# Altium schematic sheet MAIN BOARD POWER.SchDoc: BULLSEYE
size A3; CompanyName: TYMPHANY; DrawnBy: Yetta.He; Organization: PABU; Address1: 11F,block A, CEC building,; Address2: No.2070 Shennan Zhong road,; Address3: Huaqiang North, Futian District,; Address4: Shenzhen,  Guang Dong, P.R.C 518000; DocumentNumber: 7; Revision: 0.0.5; SheetNumber: 7; SheetTotal: 7; Size: A3; Status: DP1
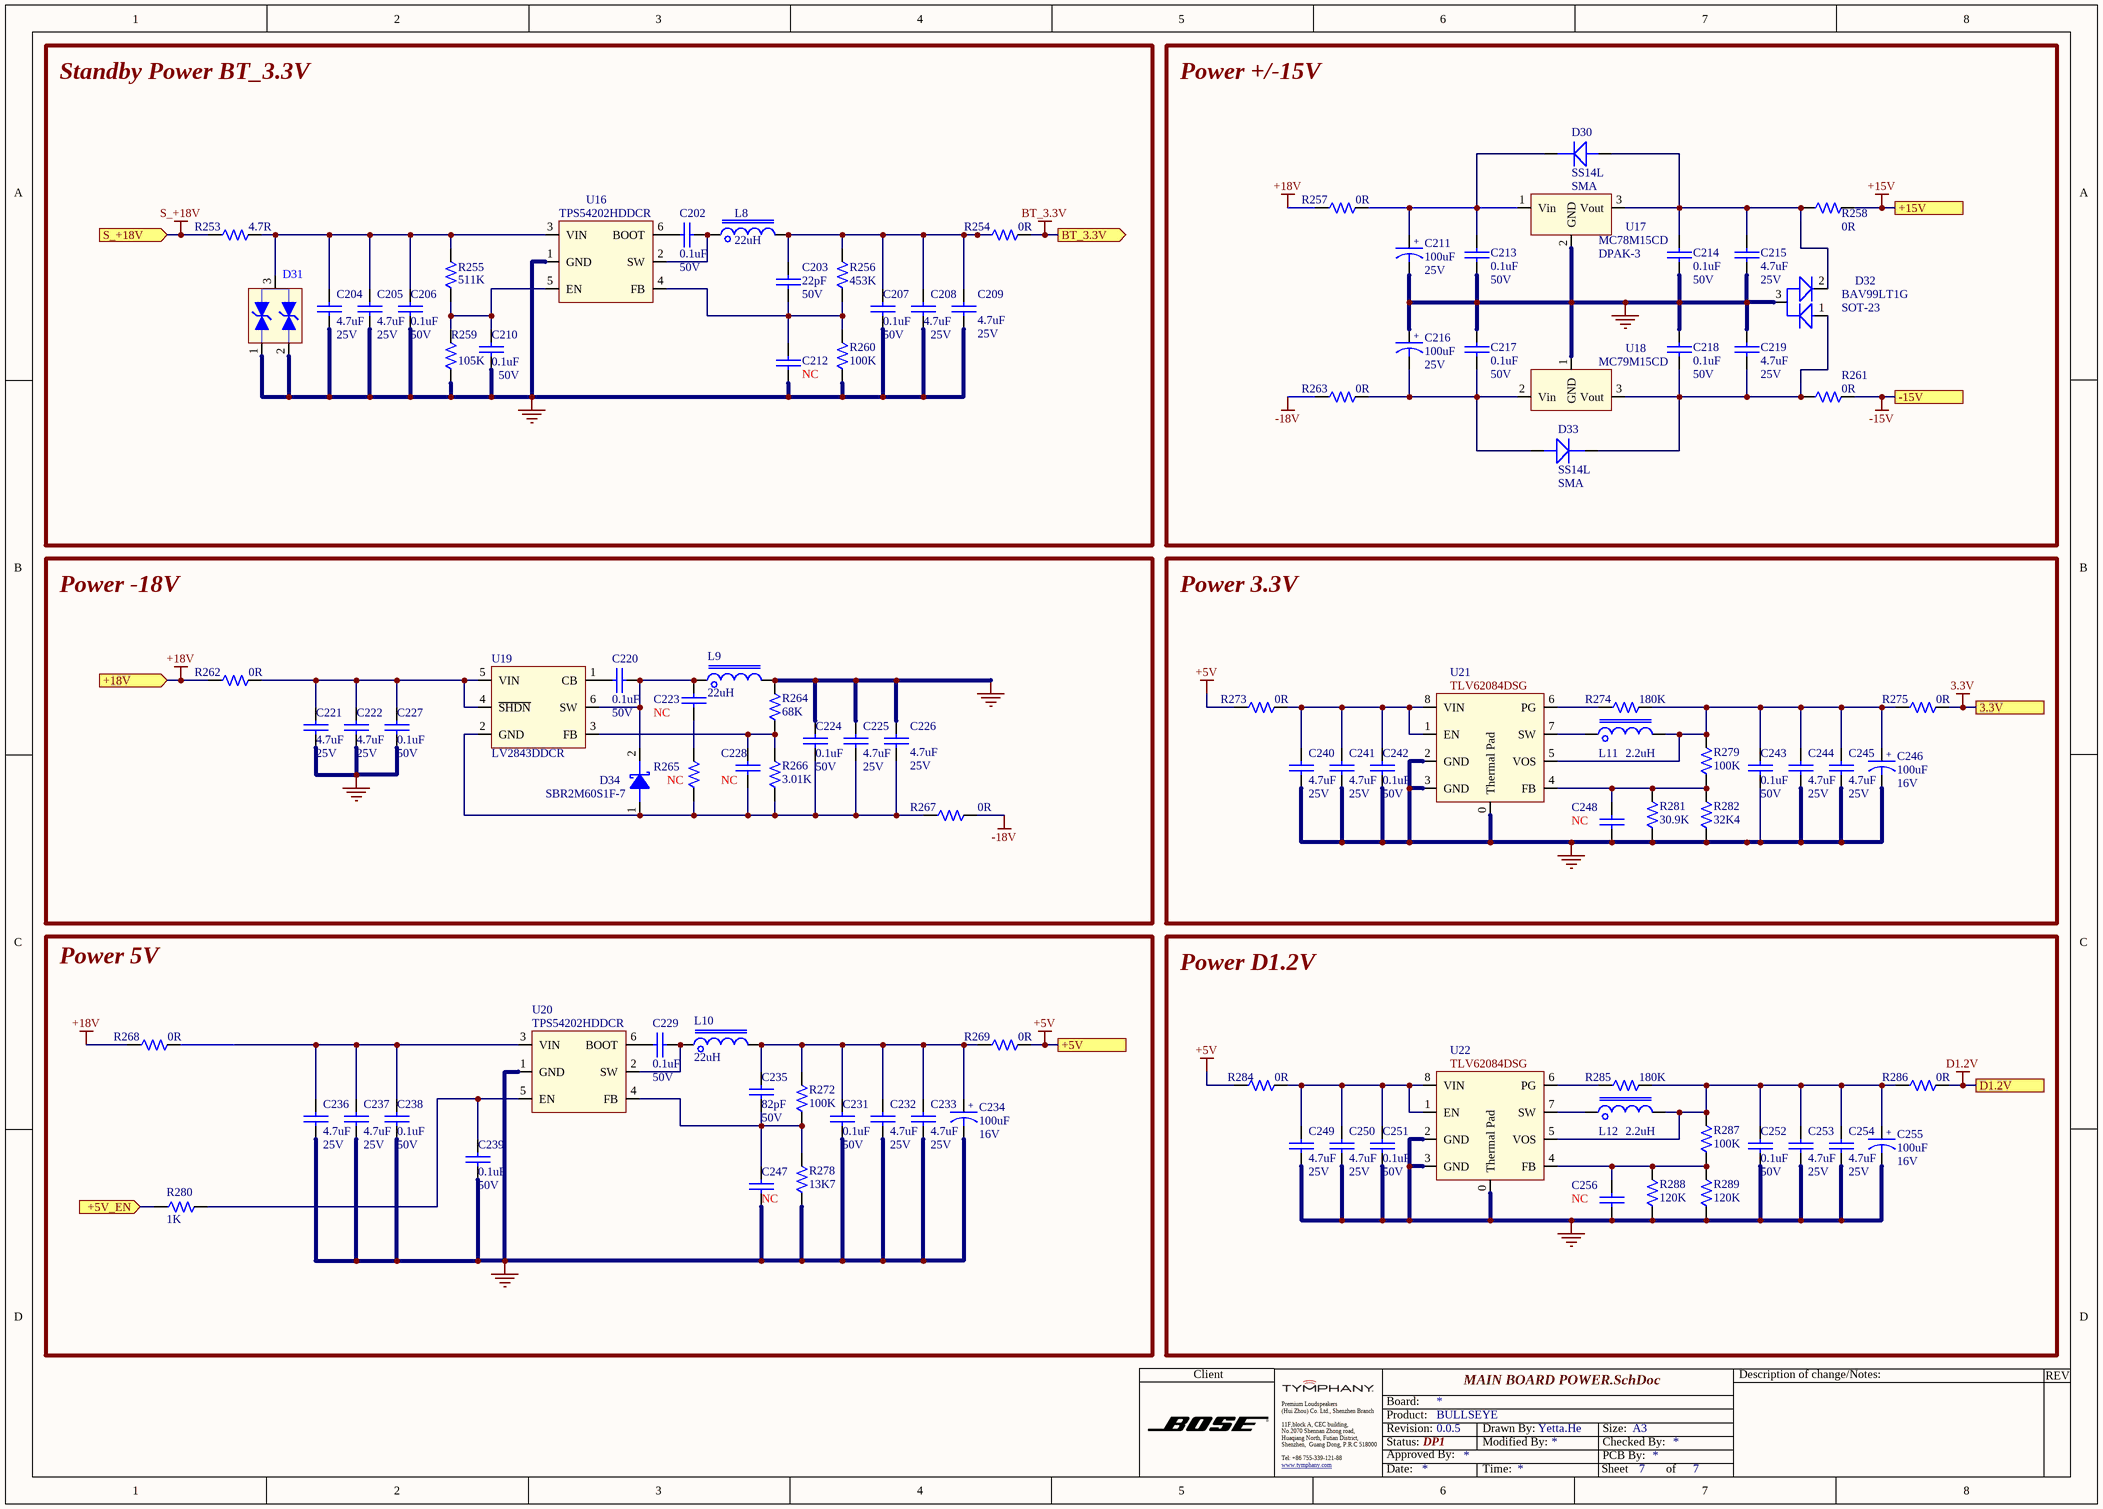
[diagram p0: MAIN BOARD POWER.SchDoc]

## Parts
C202  value 0.1uF  Voltage: 50V  [CAPC0402-RW]  (hidden comment: PWL456470-1040)
C203  value 22pF  Voltage: 50V  [CAPC0402-RW]  (hidden comment: PWL410370-2200)
C204  value 4.7uF  Voltage: 25V  [CAPC0603-RW]  (hidden comment: T542024757408)
C205  value 4.7uF  Voltage: 25V  [CAPC0603-RW]  (hidden comment: T542024757408)
C206  value 0.1uF  Voltage: 50V  [CAPC0402-RW]  (hidden comment: PWL456470-1040)
C207  value 0.1uF  Voltage: 50V  [CAPC0402-RW]  (hidden comment: PWL456470-1040)
C208  value 4.7uF  Voltage: 25V  [CAPC0603-RW]  (hidden comment: T542024757408)
C209  value 4.7uF  Voltage: 25V  [CAPC0603-RW]  (hidden comment: T542024757408)
C210  value 0.1uF  Voltage: 50V  [CAPC0402-RW]  (hidden comment: PWL456470-1040)
C211  value 100uF  Voltage: 25V  [CASE - D8]  (hidden comment: T551101445020)
C212  value NC  [CAPC0603-RW]  (hidden comment: CAP0603 NC)
C213  value 0.1uF  Voltage: 50V  [CAPC0402-RW]  (hidden comment: PWL456470-1040)
C214  value 0.1uF  Voltage: 50V  [CAPC0402-RW]  (hidden comment: PWL456470-1040)
C215  value 4.7uF  Voltage: 25V  [CAPC0603-RW]  (hidden comment: T542024757408)
C216  value 100uF  Voltage: 25V  [CASE - D8]  (hidden comment: T551101445020)
C217  value 0.1uF  Voltage: 50V  [CAPC0402-RW]  (hidden comment: PWL456470-1040)
C218  value 0.1uF  Voltage: 50V  [CAPC0402-RW]  (hidden comment: PWL456470-1040)
C219  value 4.7uF  Voltage: 25V  [CAPC0603-RW]  (hidden comment: T542024757408)
C220  value 0.1uF  Voltage: 50V  [CAPC0402-RW]  (hidden comment: PWL456470-1040)
C221  value 4.7uF  Voltage: 25V  [CAPC0603-RW]  (hidden comment: T542024757408)
C222  value 4.7uF  Voltage: 25V  [CAPC0603-RW]  (hidden comment: T542024757408)
C223  value NC  [CAPC0603-RW]  (hidden comment: CAP0603 NC)
C224  value 0.1uF  Voltage: 50V  [CAPC0402-RW]  (hidden comment: PWL456470-1040)
C225  value 4.7uF  Voltage: 25V  [CAPC0603-RW]  (hidden comment: T542024757408)
C226  value 4.7uF  Voltage: 25V  [CAPC0603-RW]  (hidden comment: T542024757408)
C227  value 0.1uF  Voltage: 50V  [CAPC0402-RW]  (hidden comment: PWL456470-1040)
C228  value NC  [CAPC0402-RW]  (hidden comment: CAP0402 NC)
C229  value 0.1uF  Voltage: 50V  [CAPC0402-RW]  (hidden comment: PWL456470-1040)
C231  value 0.1uF  Voltage: 50V  [CAPC0402-RW]  (hidden comment: PWL456470-1040)
C232  value 4.7uF  Voltage: 25V  [CAPC0603-RW]  (hidden comment: T542024757408)
C233  value 4.7uF  Voltage: 25V  [CAPC0603-RW]  (hidden comment: T542024757408)
C234  value 100uF  Voltage: 16V  [CASE - D]  (hidden comment: T551101435040)
C235  value 82pF  Voltage: 50V  [CAPC0603-RW]  (hidden comment: T541028206508)
C236  value 4.7uF  Voltage: 25V  [CAPC0603-RW]  (hidden comment: T542024757408)
C237  value 4.7uF  Voltage: 25V  [CAPC0603-RW]  (hidden comment: T542024757408)
C238  value 0.1uF  Voltage: 50V  [CAPC0402-RW]  (hidden comment: PWL456470-1040)
C239  value 0.1uF  Voltage: 50V  [CAPC0402-RW]  (hidden comment: PWL456470-1040)
C240  value 4.7uF  Voltage: 25V  [CAPC0603-RW]  (hidden comment: T542024757408)
C241  value 4.7uF  Voltage: 25V  [CAPC0603-RW]  (hidden comment: T542024757408)
C242  value 0.1uF  Voltage: 50V  [CAPC0402-RW]  (hidden comment: PWL456470-1040)
C243  value 0.1uF  Voltage: 50V  [CAPC0402-RW]  (hidden comment: PWL456470-1040)
C244  value 4.7uF  Voltage: 25V  [CAPC0603-RW]  (hidden comment: T542024757408)
C245  value 4.7uF  Voltage: 25V  [CAPC0603-RW]  (hidden comment: T542024757408)
C246  value 100uF  Voltage: 16V  [CASE - D]  (hidden comment: T551101435040)
C247  value NC  [CAPC0603-RW]  (hidden comment: CAP0603 NC)
C248  value NC  [CAPC0402-RW]  (hidden comment: CAP0402 NC)
C249  value 4.7uF  Voltage: 25V  [CAPC0603-RW]  (hidden comment: T542024757408)
C250  value 4.7uF  Voltage: 25V  [CAPC0603-RW]  (hidden comment: T542024757408)
C251  value 0.1uF  Voltage: 50V  [CAPC0402-RW]  (hidden comment: PWL456470-1040)
C252  value 0.1uF  Voltage: 50V  [CAPC0402-RW]  (hidden comment: PWL456470-1040)
C253  value 4.7uF  Voltage: 25V  [CAPC0603-RW]  (hidden comment: T542024757408)
C254  value 4.7uF  Voltage: 25V  [CAPC0603-RW]  (hidden comment: T542024757408)
C255  value 100uF  Voltage: 16V  [CASE - D]  (hidden comment: T551101435040)
C256  value NC  [CAPC0402-RW]  (hidden comment: CAP0402 NC)
D30  MFG Part: SS14L  Package: SMA  [subSMA]  (hidden comment: RCD100140-0010)
D31  RCD100012-0001  [SOT23-132-RW]  (value not drawn)
D32  Package: SOT-23  [SOT23-132-RW]  (hidden comment: RCD100099-0010)
D33  MFG Part: SS14L  Package: SMA  [subSMA]  (hidden comment: RCD100140-0010)
D34  MFG Part: SBR2M60S1F-7  [SOD-123]  (hidden comment: T572006161416)
L8  value 22uH  [IND CKST0505]  (hidden comment: T621000054100)
L9  value 22uH  [IND CKST0505]  (hidden comment: T621000054100)
L10  value 22uH  [IND CKST0505]  (hidden comment: T621000054100)
L11  value 2.2uH  [IND CKCD3D16]  (hidden comment: T621000042300)
L12  value 2.2uH  [IND CKCD3D16]  (hidden comment: T621000042300)
R253  value 4.7R  [0805-RW]  (hidden comment: QCF081020-4708)
R254  value 0R  [0805-RW]  (hidden comment: T502000003009)
R255  value 511K  [0603-RW]  (hidden comment: QCF011030-5113)
R256  value 453K  [0402-RW]  (hidden comment: T502453301399)
R257  value 0R  [0805-RW]  (hidden comment: T502000003009)
R258  value 0R  [0805-RW]  (hidden comment: T502000003009)
R259  value 105K  [0603-RW]  (hidden comment: T502105302399)
R260  value 100K  [0603-RW]  (hidden comment: QCF011030-1003)
R261  value 0R  [0805-RW]  (hidden comment: T502000003009)
R262  value 0R  [0805-RW]  (hidden comment: T502000003009)
R263  value 0R  [0805-RW]  (hidden comment: T502000003009)
R264  value 68K  [0603-RW]  (hidden comment: QCF011030-6802)
R265  value NC  [0603-RW]  (hidden comment: RES0603 NC)
R266  value 3.01K  [0603-RW]  (hidden comment: QCF011030-3011)
R267  value 0R  [0805-RW]  (hidden comment: T502000003009)
R268  value 0R  [0805-RW]  (hidden comment: T502000003009)
R269  value 0R  [0805-RW]  (hidden comment: T502000003009)
R272  value 100K  [0603-RW]  (hidden comment: QCF011030-1003)
R273  value 0R  [0805-RW]  (hidden comment: T502000003009)
R274  value 180K  [0402-RW]  (hidden comment: QCF161240-1803)
R275  value 0R  [0805-RW]  (hidden comment: T502000003009)
R278  value 13K7  [0603-RW]  (hidden comment: T502137202399)
R279  value 100K  [0603-RW]  (hidden comment: QCF011030-1003)
R280  value 1K  [0603-RW]  (hidden comment: QCF011030-1001)
R281  value 30.9K  [0603-RW]  (hidden comment: QCF011030-3092)
R282  value 32K4  [0402-RW]  (hidden comment: QCF161240-3242)
R284  value 0R  [0805-RW]  (hidden comment: T502000003009)
R285  value 180K  [0402-RW]  (hidden comment: QCF161240-1803)
R286  value 0R  [0805-RW]  (hidden comment: T502000003009)
R287  value 100K  [0603-RW]  (hidden comment: QCF011030-1003)
R288  value 120K  [0603-RW]  (hidden comment: QCF011030-1203)
R289  value 120K  [0603-RW]  (hidden comment: QCF011030-1203)
U16  MFG Part: TPS54202HDDCR  [SOT23-6 P.95]  (hidden comment: T611700039022)
U17  T610600097341  [DPAK-3]  (value not drawn)
U18  T610600097241  [DPAK-3]  (value not drawn)
U19  MFG Part: LV2843DDCR  [DBV(R-PDSO-G6)]  (hidden comment: RCI002843-0001)
U20  MFG Part: TPS54202HDDCR  [SOT23-6 P.95]  (hidden comment: T611700039022)
U21  T611700037422  [DSG(S-PWSON-N8)]  (value not drawn)
U22  T611700037422  [DSG(S-PWSON-N8)]  (value not drawn)

## Blocks framed on the sheet
Standby Power BT_3.3V: C202-C210 C212 D31 L8 R253-R256 R259 R260 U16
Power +/-15V: C211 C213-C219 D30 D32 D33 R257 R258 R261 R263 U17 U18
Power -18V: C220-C228 D34 L9 R262 R264-R267 U19
Power 3.3V: C240-C246 C248 L11 R273-R275 R279 R281 R282 U21
Power 5V: C229 C231-C239 C247 L10 R268 R269 R272 R278 R280 U20
Power D1.2V: C249-C256 L12 R284-R289 U22

## Ports
3.3V, +5V, +5V_EN (in), +15V, +18V (in), -15V, BT_3.3V (out), D1.2V, S_+18V (in)

## Nets
3.3V: R275.2 ; port 3.3V
+5V: R269.2 R273.1 R284.1 ; port +5V
+15V: R258.2 ; port +15V
+18V: R257.1 R262.1 R268.1 ; port +18V
-15V: R261.2 ; port -15V
-18V: R263.1 R267.2
BT_3.3V: R254.2 ; port BT_3.3V
D1.2V: R286.2 ; port D1.2V
GND: C204.2 C205.2 C206.2 C207.2 C208.2 C209.2 C210.2 C211.2 C212.2 C213.2 C214.2 C215.2 C216.1 C217.1 C218.1 C219.1 C221.2 C222.2 C224.1 C225.1 C226.1 C227.2 C231.2 C232.2 C233.2 C234.2 C236.2 C237.2 C238.2 C239.2 C240.2 C241.2 C242.2 C243.2 C244.2 C245.2 C246.2 C247.2 C248.2 C249.2 C250.2 C251.2 C252.2 C253.2 C254.2 C255.2 C256.2 D31.1(A) D31.2(A) D32.3(K) L9.2 R259.1 R260.1 R264.2 R278.1 R281.1 R282.1 R288.1 R289.1 U16.1(GND) U17.2(GND) U18.1(GND) U20.1(GND) U21.0(Thermal_Pad) U21.2(GND) U21.3(GND) U22.0(Thermal_Pad) U22.2(GND) U22.3(GND)
S_+18V: R253.1 ; port S_+18V
+5V_EN: R280.1 ; port +5V_EN
NetC202_1: C202.1 U16.6(BOOT)
NetC202_2: C202.2 L8.1 U16.2(SW)
NetC203_1: C203.1 C207.1 C208.1 C209.1 L8.2 R254.1 R256.2
NetC203_2: C203.2 C212.1 R256.1 R260.2 U16.4(FB)
NetC204_1: C204.1 C205.1 C206.1 D31.3(K) R253.2 R255.2 U16.3(VIN)
NetC210_1: C210.1 R255.1 R259.2 U16.5(EN)
NetC211_1: C211.1 C213.1 D30.2(K) R257.2 U17.1(Vin)
NetC214_1: C214.1 C215.1 D30.1(A) D32.2(A) R258.1 U17.3(Vout)
NetC216_2: C216.2 C217.2 D33.1(A) R263.2 U18.2(Vin)
NetC218_2: C218.2 C219.2 D32.1(A) D33.2(K) R261.1 U18.3(Vout)
NetC220_1: C220.1 U19.1(CB)
NetC220_2: C220.2 C223.1 D34.2(K) L9.1 U19.6(SW)
NetC221_1: C221.1 C222.1 C227.1 R262.2 U19.4(~{SHDN}) U19.5(VIN)
NetC223_2: C223.2 R265.2
NetC224_2: C224.2 C225.2 C226.2 C228.2 D34.1(A) R265.1 R266.1 R267.1 U19.2(GND)
NetC228_1: C228.1 R264.1 R266.2 U19.3(FB)
NetC229_1: C229.1 U20.6(BOOT)
NetC229_2: C229.2 L10.1 U20.2(SW)
NetC231_1: C231.1 C232.1 C233.1 C234.1 C235.1 L10.2 R269.1 R272.2
NetC235_2: C235.2 C247.1 R272.1 R278.2 U20.4(FB)
NetC236_1: C236.1 C237.1 C238.1 R268.2 U20.3(VIN)
NetC239_1: C239.1 R280.2 U20.5(EN)
NetC240_1: C240.1 C241.1 C242.1 R273.2 U21.1(EN) U21.8(VIN)
NetC243_1: C243.1 C244.1 C245.1 C246.1 L11.2 R274.2 R275.1 R279.2 U21.5(VOS)
NetC248_1: C248.1 R279.1 R281.2 R282.2 U21.4(FB)
NetC249_1: C249.1 C250.1 C251.1 R284.2 U22.1(EN) U22.8(VIN)
NetC252_1: C252.1 C253.1 C254.1 C255.1 L12.2 R285.2 R286.1 R287.2 U22.5(VOS)
NetC256_1: C256.1 R287.1 R288.2 R289.2 U22.4(FB)
NetL11_1: L11.1 U21.7(SW)
NetL12_1: L12.1 U22.7(SW)
NetR274_1: R274.1 U21.6(PG)
NetR285_1: R285.1 U22.6(PG)

## Notes on the sheet
- Client
- Description of change/Notes:
- REV
- Premium Loudspeakers
- (Hui Zhou) Co. Ltd., Shenzhen Branch
- Tel: +86 755-339-121-88
- Board:
- Status:
- Revision:
- Product:
- Approved By:
- Drawn By:
- Modified By:
- Checked By:
- PCB By:
- Size:
- www.tymphany.com <http://www.tymphany.com>
- Date:
- Time:
- Sheet
- of
- (in symbol CAP E 100uF 16V 20% SMD-VZH101M1CTR-0605) +
- (in symbol CAP E 100uF 25V 20% SMD_VEJ101M1ETR-0607) +

## Library data of the parts
C202 C206 C207 C210 C213 C214 C217 C218 C220 C224 C227 C229 C231 C238 C239 C242 C243 C251 C252 = CAP0402 0.1uF 50V 10%: CAP X7R .10UF 50V +-10% 0402 WALSIN L; SAP: T542011047508; Tolerance: 10%; Type: Capacitor; CREATE_NAME: TOM@Deftronics; DIP&SMD: SMD; PACKAGE: CAPC0402; Vendor Name: *; MFG: *; MFG Part: *; Other: X7R; CREATE_TIME: 13-May-2014; Customer Specific: N/A
C203 = CAP0402 22pF 50V 5%: CHIP CAP 5% 50V 0402 NPO 22pF; SAP: T541012206508; Type: Capacitor; CREATE_NAME: GordonL@Deftronics; DIP&SMD: SMD; PACKAGE: CAPC0402; Vendor Code: *; Vendor Name: *; MFG: *; MFG Part: *; Other: NPO; Tolerance: 5%; CREATE_TIME: 08-MAR-2013; Customer Specific: N/A
C204 C205 C215 C219 C221 C222 C225 C226 C236 C237 C240 C241 C249 C250 = CAP0603 4.7uF 25V 10%_X7R_WALSIN: CAP X7R 4.7UF 25V +-10% 0603 WALSIN L; Tolerance: 10%; Type: Capacitor; CREATE_NAME: Nathan; DIP&SMD: SMD; SAP: T542024757408; PACKAGE: CAPC0603; Vendor Name: *; MFG: WALSIN; MFG Part: *; Other: X7R; CREATE_TIME: 13-July-2016; Customer Specific: N/A
C208 C209 C232 C233 C244 C245 C253 C254 = CAP0603 4.7uF 25V 10%_X7R_WALSIN: CAP X7R 4.7UF 25V +-10% 0603 WALSIN L; Tolerance: 10%; Type: Capacitor; DIP&SMD: SMD; CREATE_NAME: Nathan; SAP: T542024757408; PACKAGE: CAPC0603; Vendor Name: *; MFG: WALSIN; MFG Part: *; Other: X7R; Customer Specific: N/A; CREATE_TIME: 13-July-2016
C211 C216 = CAP E 100uF 25V 20% SMD_VEJ101M1ETR-0607: E 100UF 25V +-20% 6.3X7. VEJ101M1E K; MFG: LELON; Tolerance: 20%; Type: Capacitor; CREATE_NAME: Nathan; DIP&SMD: SMD; SAP: T551101445020; PACKAGE: CASE - C7.7; Vendor Name: *; Vendor Code: *; MFG Part: VEJ101M1ETR-0607; Other: *; CREATE_TIME: 01-Mar-2019; Customer Specific: N/A
C212 C223 C247 = CAP0603 NC: NC; Type: Capacitor; CREATE_NAME: Tom; DIP&SMD: SMD; SAP: *; PACKAGE: CAPC0603; Vendor Code: *; Vendor Name: *; MFG: *; MFG Part: *; Other: *; Tolerance: *; CREATE_TIME: 18-Mar-2016; Voltage: *; Customer Specific: N/A
C228 C248 C256 = CAP0402 NC: NC; Type: Capacitor; CREATE_NAME: Tom; DIP&SMD: SMD; SAP: *; PACKAGE: CAPC0402; Vendor Code: *; Vendor Name: *; MFG: *; MFG Part: *; Other: *; Tolerance: *; CREATE_TIME: 18-Mar-2016; Voltage: *; Customer Specific: N/A
C234 = CAP E 100uF 16V 20% SMD-VZH101M1CTR-0605: E 100UF 16V +-20% 6.3*5. VZH101M1C L; MFG: LELON; Tolerance: 20%; Type: Capacitor; CREATE_NAME: Nathan; DIP&SMD: SMD; SAP: T551101435040; PACKAGE: CASE - D; Vendor Name: *; Vendor Code: *; MFG Part: VZH101M1CTR-0605; Other: *; CREATE_TIME: 03-May-2019; Customer Specific: N/A
C235 = CAP0603 82pF 50V 5%_NPO_WALSIN: CAP NPO 82PF 50V +-5% 0603 WALSIN L; Tolerance: 5%; Type: Capacitor; CREATE_NAME: Nathan; SAP: T541028206508; PACKAGE: CAPC0603; Vendor Name: *; MFG: WALSIN; MFG Part: *; Other: NPO; CREATE_TIME: 25-Oct-2016
C246 C255 = CAP E 100uF 16V 20% SMD-VZH101M1CTR-0605: E 100UF 16V +-20% 6.3*5. VZH101M1C L; MFG: LELON; Type: Capacitor; CREATE_NAME: Nathan; DIP&SMD: SMD; Tolerance: 20%; SAP: T551101435040; PACKAGE: CASE - D; MFG Part: VZH101M1CTR-0605; Other: *; CREATE_TIME: 03-May-2019; Customer Specific: N/A; Vendor Name: *; Vendor Code: *
D30 D33 = SS14L-TSC: SMD Schottky Diode Sub SMA 1A 40V SS14L; MFG: TSC; SAP: T571000130604; Vendor Name: *; Vendor Code: *; Voltage: 40V; Current: 1A; Type: DIODE; DIP&SMD: SMD; Customer Specific: N/A
D31 = ESDCAN01-2BLY: CHIP DIODE ESD CAN01-2BLY SOT23 24V 5.5A; MFG: ST; SAP: T593000205100; Ppp: 230W; CREATE_NAME: Nathan; Type: ESD DIODE; Ipp: 5.5A; Vendor Code: *; Vendor Name: *; CREATE_TIME: 21-Apr-2015; Vrm: 24V; MFG Part: ESDCAN01-2BLY
D32 = BAV99LT1G: SWITC 70V 215MA BAV99LT1G ON SE G; SAP: T572003550122; MFG: ON SEMI; Voltage: 100V; Power: 225MW; Type: DIODE; DIP&SMD: SMD; Vendor Code: *; Vendor Name: *; Current: 215mA; Customer Specific: N/A; MFG Part: BAV99LT1G
D34 = DIO SBR2M60S1F-7: SWITC 0.7V 2A SBR2M60S1F-7 DIODE L; MFG: DIODES; Voltage: 50V; Current: 5.0A; CREATE_NAME: Nathan; DIP&SMD: SMD; SAP: T572006161416; Vendor Name: *; Vendor Code: *; CREATE_TIME: 16-Mar-2017; Type: DIODE; Package: SOD123F; Customer Specific: N/A
L8-L10 = IND 22uH CKST0505-22UH\M: 22UH 2 5A 100K 5.7X CENKER CKST050 K; Type: INDUCTOR; CREATE_NAME: Nathan; Irms: 1.5A; DCR: 238mΩ; Isat: 2.5A; DIP&SMD: SMD; SAP: T621000054100; MFG: CENKER; Vendor Code: *; Vendor Name: *; CREATE_TIME: 27-Dec-2017; MFG Part: CKST0505-22UH\M
L11 L12 = IND 2.2uH CKCD3D16-2.2uH: 2.2UH 1.5A 100K SMD CENKER CKCD3D1 K; MFG Part: CKCD3D16-2.2UH\N; Type: INDUCTOR; CREATE_NAME: Nathan; DCR: 100mOHM; Idc: 1.2A; SAP: T621000042300; MFG: CENKER; Vendor Code: *; Vendor Name: *; CREATE_TIME: 08-Nov-2018; DIP&SMD: SMD
R253 = RES0805 1/8W 1% 4.7 OHM: GP CHIP RES 4.7 OHM 1/8W 1% 0805; Vendor Code: 10010262; SAP: T502470B03399; Vendor Name: 东莞市晴远电子有限公司; DIP&SMD: SMD; Power: 1/8W; MFG Part: *; MFG: *; TOL: 1%; Type: Resistor; PACKAGE: 0805; Customer Specific: N/A
R254 R257 R258 R261-R263 R267-R269 R273 R275 R284 R286 = RES0805 1/8W  0 OHM_WALSIN: CHIP 0 OHM 0 OHM 0 OHM 0805 WALSI L; Power: 1/8W; MFG: WALSIN; CREATE_Name: Tom; DIP&SMD: SMD; Vendor Code: *; SAP: T502000003009; Vendor Name: *; MFG Part: *; TOL: *; Type: Resistor; CREATE_Time: 27-Jun-2018; PACKAGE: 0805; Customer Specific: N/A
R255 = RES0603 1/10W 1% 511K OHM: CHIP RES 511K OHM 1% 1/10W 0603; SAP: T502511302399; CREATE_NAME: TOM@Deftronics; Vendor Code: *; Power: *; Vendor Name: *; MFG: *; MFG Part: *; TOL: 1%; Type: Resistor; CREATE_TIME: 21-Nov-2013; PACKAGE: 0603
R256 = RES0402 1/16W 1% 453K OMH_WALSIN: CHIP 453K OHM  100PPM +-1% 0402 WALS; TOL: 1%; MFG: WALSIN (華新); Power: 1/16W; CREATE_NAME: Nathan; SAP: T502453301399; Package: 0402; MFG Part: *; Vendor Code: *; Vendor Name: *; Type: Resistor; CREATE_TIME: 25-May-2016
R259 = RES0603 1/10W 1% 105K OHM_WALSIN: CHIP 105K OHM  100PPM +-1% 0603 WALS L; MFG Part: WR06X1053FTL; MFG: WALSIN (華新); TOL: 1%; CREAT_NAME: Nathan; Vendor Code: *; SAP: T502105302399; Power: *; Vendor Name: *; Type: Resistor; PACKAGE: 0603; CREAT_TIME: 03-July-2016
R260 R272 = RES0603 1/10W 1% 100K OHM: GP CHIP RES. 100K OHM 1/10W 1% 0603; Vendor Code: 10010262; SAP: T502100302399; Vendor Name: 东莞市晴远电子有限公司; Power: *; MFG Part: *; MFG: *; TOL: 1%; Type: Resistor; PACKAGE: 0603
R264 = RES0603 1/10W 1% 68K OHM: GP CHIP RES. 68K OHM 1/10W 1% 0603; Vendor Code: 10010262; SAP: T502680202399; Vendor Name: 东莞市晴远电子有限公司; DIP&SMD: SMD; Power: 1/10W; MFG Part: *; MFG: *; TOL: 1%; Type: Resistor; PACKAGE: 0603; Customer Specific: N/A
R265 = RES0603 NC: NC; CREATE_NAME: Tom; DIP&SMD: SMD; SAP: *; Tolerance: *; MFG Part: *; MFG: *; Vendor Code: *; Vendor Name: *; Type: Resistor; Power: *; CREATE_TIME: 18-Mar-2016; Customer Specific: N/A; Package: 0603
R266 = RES0603 1/10W 1% 3.01K OHM: CHIP RES 3.01K OHM 1% 1/10W  0603; SAP: T502301102399; CREATE_NAME: TOM@Deftronics; DIP&SMD: SMD; Vendor Code: *; Power: 1/10W; Vendor Name: *; MFG: *; MFG Part: *; TOL: 1%; Type: Resistor; CREATE_TIME: 21-Nov-2013; PACKAGE: 0603; Customer Specific: N/A
R274 R285 = RES0402 1/16W 1% 180K OHM 100PPM: CHIP RES 100ppm 180K OHM 1% 1/16W 0402; SAP: T502180301399; CREATE_NAME: GordonL@Deftronics; DIP&SMD: SMD; Vendor Code: *; Power: 1/16W; Vendor Name: *; MFG Part: *; MFG: *; TOL: 1%; Type: Resistor; CREATE_TIME: 11-Mar-2014; PACKAGE: 0402; Customer Specific: N/A
R278 = RES0603 1/10W 1% 13.7K OHM_WALSIN: CHIP 13.7K OHM 100PPM +-1% 0603 WALS L; MFG: WALSIN (華新); TOL: 1%; CREAT_NAME: Nathan; Vendor Code: *; SAP: T502137202399; Power: *; Vendor Name: *; MFG Part: *; Type: Resistor; PACKAGE: 0603; CREAT_TIME: 03-July-2016
R279 R287 = RES0603 1/10W 1% 100K OHM: GP CHIP RES. 100K OHM 1/10W 1% 0603; Vendor Code: 10010262; SAP: T502100302399; Vendor Name: 东莞市晴远电子有限公司; DIP&SMD: SMD; Power: 1/10W; MFG Part: *; MFG: *; TOL: 1%; Type: Resistor; PACKAGE: 0603; Customer Specific: N/A
R280 = RES0603 1/10W 1% 1K OHM: GP CHIP RES. 1K OHM 1/10W 1% 0603; Vendor Code: 10010262; SAP: T502100102399; Vendor Name: 东莞市晴远电子有限公司; DIP&SMD: SMD; Power: 1/10W; MFG Part: *; MFG: *; TOL: 1%; Type: Resistor; PACKAGE: 0603; Customer Specific: N/A
R281 = RES0603 1/10W 1% 30.9K OHM: CHIP RES. 30.9K OHM 1/10W 1% 0603; Vendor Code: 10010262; SAP: T502309202399; Vendor Name: 东莞市晴远电子有限公司; DIP&SMD: SMD; Power: 1/10W; MFG Part: *; MFG: *; TOL: 1%; Type: Resistor; PACKAGE: 0603; Customer Specific: N/A
R282 = RES0402 1/16W 1% 32.4K OHM: CHIP RES 32.4K OHM 1% 1/16W 0402; SAP: T502324201399; CREATE_NAME: GordonL@Deftronics; DIP&SMD: SMD; Vendor Code: *; Power: 1/16W; Vendor Name: *; MFG Part: *; MFG: *; TOL: 1%; Type: Resistor; CREATE_TIME: 11-Mar-2014; PACKAGE: 0402; Customer Specific: N/A
R288 R289 = RES0603 1/10W 1% 120K OHM: CHIP RES 120K OHM 1% 1/10W 0603; Vendor Code: 10010262; SAP: T502120K02399; Vendor Name: 东莞市晴远电子有限公司; DIP&SMD: SMD; Power: 1/10W; MFG Part: *; MFG: *; TOL: 1%; Type: Resistor; PACKAGE: 0603; Customer Specific: N/A
U16 U20 = TPS54202: DC DC CVT TPS54202HDD SOT-23(6) TI K; CREATE_NAME: Nathan; MFG: TI; SAP: T611700039022; Vendor Code: *; Vendor Name: *; Package: SOT23-6; CREATE_TIME: 09-Sep-2016
U17 = MC78M15CD: REG MC78M15CD TO-252 ON K; Voltage: 15V; CREATE_NAME: Nathan; DIP&SMD: SMD; SAP: T610600097341; MFG: ON; Vendor Code: *; Vendor Name: *; Type: IC; CREATE_TIME: 15-Mar-2019; Customer Specific: N/A; MFG Part: MC78M15CD; Package: DPAK-3
U18 = MC79M15CD: REG MC79M15CD TO-252 ON K; MFG: ON SEMICONDUCTOR; DIP&SMD: SMD; CREATE_NAME: Nathan; SAP: T610600097241; Vendor Code: *; Vendor Name: *; Type: IC; Customer Specific: N/A; CREATE_TIME: 15-MAR-2019; MFG Part: MC79M15CD
U19 = LV2843: REG LV2843 TSOT23-6 TI G; SAP: T610600090405; CREATE_NAME: Nathan; MFG: TI; Vendor Code: *; Vendor Name: *; Package: TSOT-6L; CREATE_TIME: 03-Feb-2015
U21 U22 = TLV62084DSG: DC DC CVT TLV62084DSG WSON8 TI G; CREATE_NAME: Nathan; DIP&SMD: SMD; CREATE_TIME: 11-OCT-2016; MFG: TI; SAP: T611700037422; TYPE: IC; Value: *; Vendor Code: *; Vendor Name: *; Customer Specific: N/A; MFG Part: TLV62084DSG